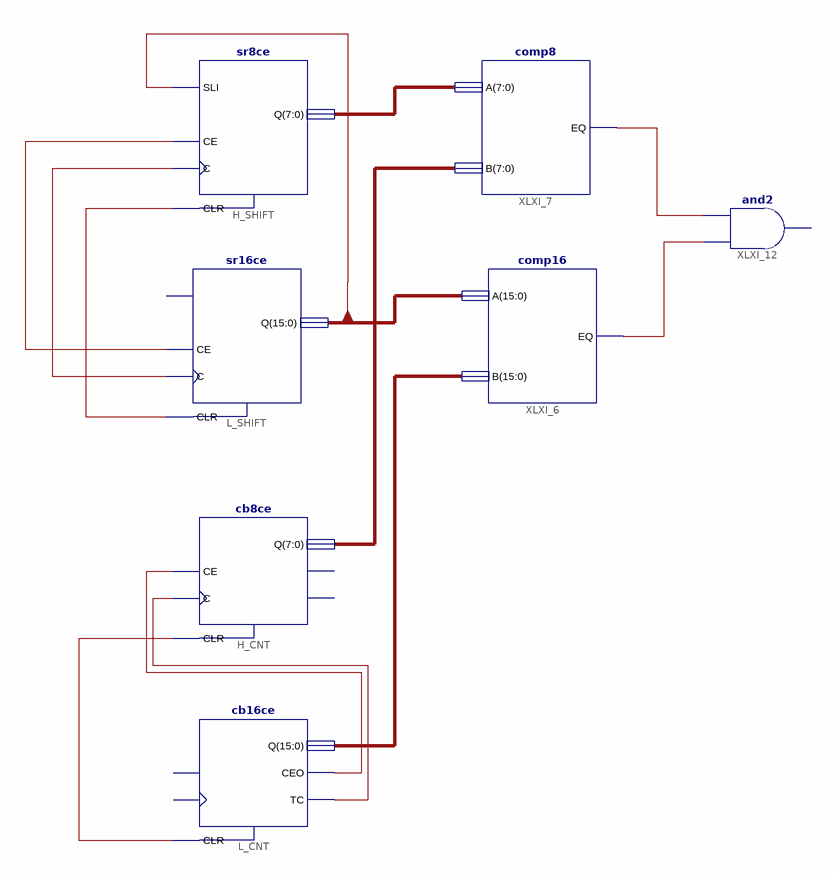
[diagram p0: schematic sheet 1]
// Xilinx ISE schematic input_cascade.sch (spartan6) as structural Verilog: 7 symbols, 0 ports
module input_cascade (
);

  wire XLXN_6, XLXN_7, XLXN_8, XLXN_9, XLXN_14, XLXN_16, XLXN_18, XLXN_19;
  wire [7:0] XLXN_1, XLXN_10;
  wire [15:0] XLXN_2, XLXN_11;

  sr16ce L_SHIFT (.C(XLXN_16), .CE(XLXN_14), .CLR(XLXN_18), .Q(XLXN_2));  // open: SLI
  sr8ce H_SHIFT (.C(XLXN_16), .CE(XLXN_14), .CLR(XLXN_18), .SLI(XLXN_2[15]), .Q(XLXN_1));
  comp16 XLXI_6 (.A(XLXN_2), .B(XLXN_11), .EQ(XLXN_7));
  comp8 XLXI_7 (.A(XLXN_1), .B(XLXN_10), .EQ(XLXN_6));
  // and2 XLXI_12 has open pins: I0=XLXN_7, I1=XLXN_6, O=open
  cb16ce L_CNT (.CLR(XLXN_19), .CEO(XLXN_8), .Q(XLXN_11), .TC(XLXN_9));  // open: C, CE
  cb8ce H_CNT (.C(XLXN_9), .CE(XLXN_8), .CLR(XLXN_19), .Q(XLXN_10));  // open: CEO, TC
endmodule
